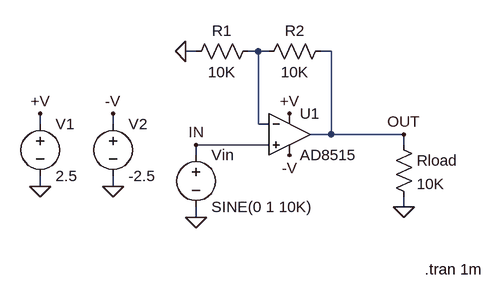
[diagram p0: schematic AD8515.asc]
AD8515.asc, the LTspice schematic file:
Version 4
SHEET 1 1240 700
WIRE 272 -1168 256 -1168
WIRE 368 -1168 352 -1168
WIRE 384 -1168 368 -1168
WIRE 480 -1168 464 -1168
WIRE 32 -1056 32 -1072
WIRE 144 -1056 144 -1072
WIRE 368 -1056 368 -1168
WIRE 384 -1056 368 -1056
WIRE 480 -1040 480 -1168
WIRE 480 -1040 448 -1040
WIRE 592 -1040 480 -1040
WIRE 384 -1024 272 -1024
WIRE 592 -1024 592 -1040
WIRE 272 -1008 272 -1024
WIRE 32 -960 32 -976
WIRE 144 -960 144 -976
WIRE 592 -928 592 -944
WIRE 272 -912 272 -928
FLAG 32 -1072 +V
FLAG 32 -960 0
FLAG 272 -912 0
FLAG 592 -1040 OUT
FLAG 272 -1024 IN
FLAG 416 -1072 +V
FLAG 144 -1072 -V
FLAG 416 -1008 -V
FLAG 256 -1168 0
FLAG 592 -928 0
FLAG 144 -960 0
SYMBOL Opamps\\AD8515 416 -1104 R0
SYMATTR InstName U1
SYMBOL voltage 32 -1072 R0
WINDOW 123 0 0 Left 2
WINDOW 39 0 0 Left 2
SYMATTR InstName V1
SYMATTR Value 2.5
SYMBOL voltage 272 -1024 R0
WINDOW 123 24 146 Left 2
WINDOW 39 24 125 Left 2
SYMATTR InstName Vin
SYMATTR Value SINE(0 1 10K)
SYMBOL res 368 -1184 R90
WINDOW 0 0 56 VBottom 2
WINDOW 3 32 56 VTop 2
SYMATTR InstName R1
SYMATTR Value 10K
SYMBOL res 480 -1184 R90
WINDOW 0 0 56 VBottom 2
WINDOW 3 32 56 VTop 2
SYMATTR InstName R2
SYMATTR Value 10K
SYMBOL voltage 144 -1072 R0
WINDOW 123 24 146 Left 2
WINDOW 39 24 125 Left 2
SYMATTR InstName V2
SYMATTR Value -2.5
SYMBOL res 576 -1040 R0
SYMATTR InstName Rload
SYMATTR Value 10K
TEXT 624 -832 Left 2 !.tran 1m

The netlist it stands for:
* AD8515.asc
XU1 IN N001 +V -V OUT AD8515  ; pins In+ In- V+ V- OUT
V1 +V 0 2.5
Vin IN 0 SINE(0 1 10K)
R1 N001 0 10K
R2 OUT N001 10K
V2 -V 0 -2.5
Rload OUT 0 10K
.tran 1m
.lib ADI.lib
.backanno
.end